# EAGLE schematic Radio (EAGLE 6.1)
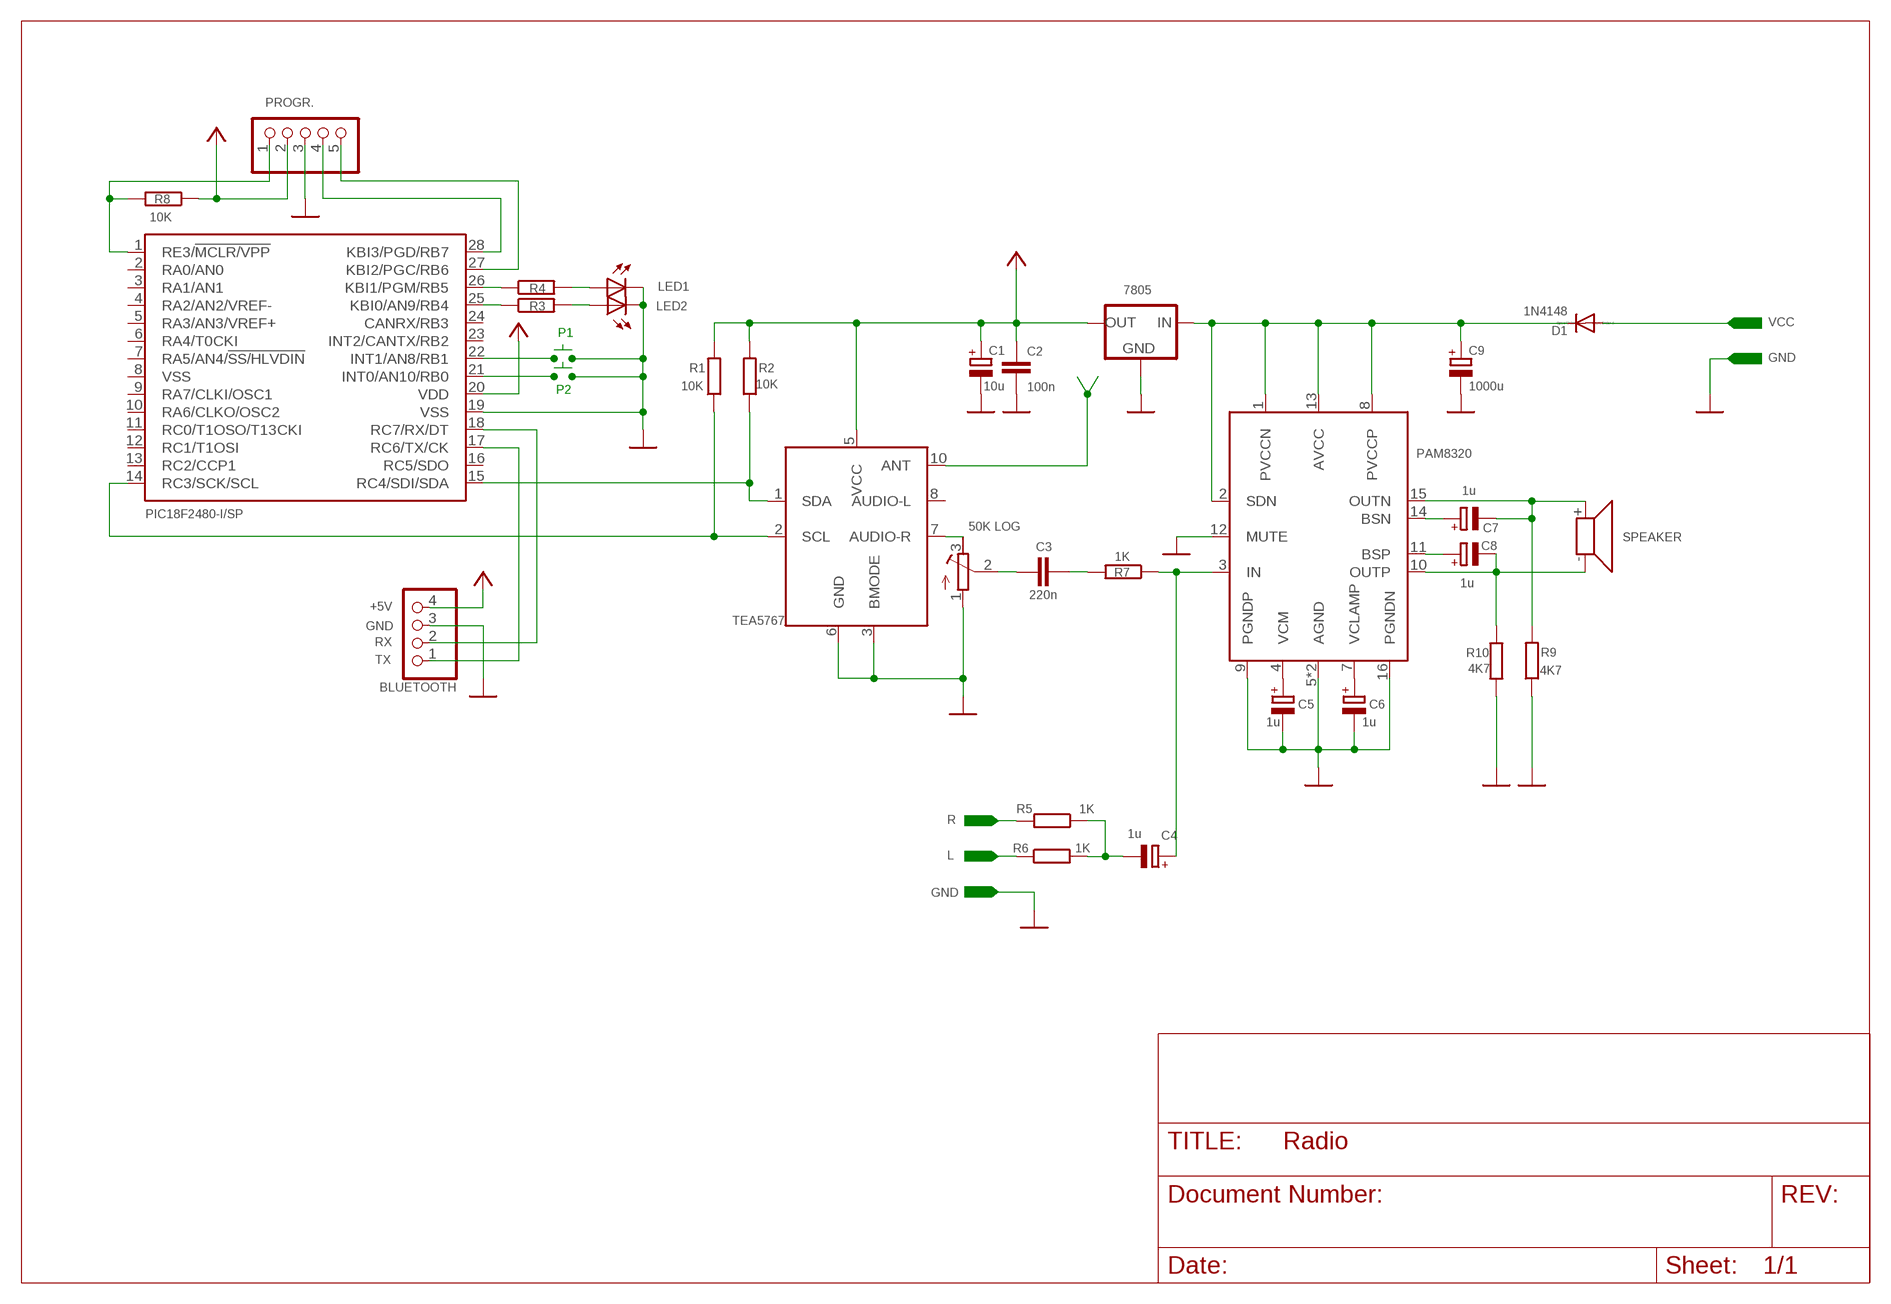
[diagram p0: schematic, sheet 1]

## Parts
7805  78XXL  [78XXL]
BLUETOOTH  PINHD-1X4  [1X04]
C1  10u  CPOL-EUE2,5-6E  [E2,5-6E]
C2  100n  C-EU050-024X044  [C050-024X044]
C3  220n  C-EU050-024X044  [C050-024X044]
C4  1u  CPOL-EUE2,5-6E  [E2,5-6E]
C5  1u  CPOL-EUE2,5-6E  [E2,5-6E]
C6  1u  CPOL-EUE2,5-6E  [E2,5-6E]
C7  1u  CPOL-EUE2,5-6E  [E2,5-6E]
C8  1u  CPOL-EUE2,5-6E  [E2,5-6E]
C9  1000u  CPOL-EUE5-13  [E5-13]
D1  1N4148  1N4148DO35-7  [DO35-7]
IC2  PIC18F2480-I/SP  [DIL28-3]
LED1  LED5MM  [LED5MM]
LED2  LED5MM  [LED5MM]
PAM8320  PAM8320  [DIL16]
POT1  50K LOG  R-TRIMM64X  [RTRIM64X]
PROGR.  PINHD-1X55X2MM  [1_05X2MM]
R1  10K  R-EU_0207/10  [0207/10]
R2  10K  R-EU_0207/10  [0207/10]
R3  2x330  R-EU_0207/10  [0207/10]
R4  330  R-EU_0207/10  [0207/10]
R5  1K  R-EU_0207/10  [0207/10]
R6  1K  R-EU_0207/10  [0207/10]
R7  1K  R-EU_0207/10  [0207/10]
R8  10K  R-EU_0207/10  [0207/10]
R9  4K7  R-EU_0207/10  [0207/10]
R10  4K7  R-EU_0207/10  [0207/10]
SPEAKER  SMS-1308MS-2-R  [SMS-1308MS-2-R]
TEA5767  TEA5767  [TEA5767]

## Nets
+5V: 7805.OUT BLUETOOTH.4 C1.+ C2.1 IC2.20(VDD) PROGR..2 R1.2 R2.2 R8.1 TEA5767.5(VCC)
GND: 7805.GND BLUETOOTH.3 C1.- C2.2 C5.- C6.- C9.- IC2.19(VSS) LED1.K(C) LED2.K(C) PAM8320.5(AGND) PAM8320.6(AGND) PAM8320.9(PGNDP) PAM8320.12(MUTE) PAM8320.16(PGNDN) POT1.1(A) PROGR..3 R9.1 R10.2 TEA5767.3(BMODE) TEA5767.6(GND)
N$2: IC2.15(RC4/SDI/SDA) R2.1 TEA5767.1(SDA)
N$3: LED1.A R4.2
N$4: POT1.3(E) TEA5767.7(AUDIO-R)
N$5: C3.1 POT1.2(S)
N$6: TEA5767.10(ANT)
N$7: C3.2 R7.2
N$8: R5.2
N$9: R6.1
N$10: C4.+ PAM8320.3(IN) R7.1
N$11: IC2.14(RC3/SCK/SCL) R1.1 TEA5767.2(SCL)
N$12: 7805.IN C9.+ D1.C PAM8320.1(PVCCN) PAM8320.2(SDN) PAM8320.8(PVCCP) PAM8320.13(AVCC)
N$13: D1.A
N$14: C5.+ PAM8320.4(VCM)
N$15: C6.+ PAM8320.7(VCLAMP)
N$16: C8.+ PAM8320.11(BSP)
N$17: C7.+ PAM8320.14(BSN)
N$18: C8.- PAM8320.10(OUTP) R10.1 SPEAKER.-
N$19: C7.- PAM8320.15(OUTN) R9.2 SPEAKER.+
N$20: IC2.21(INT0/AN10/RB0) IC2.22(INT1/AN8/RB1)
N$21: IC2.1(RE3/!MCLR/VPP) PROGR..1 R8.2
N$22: LED2.A R3.2
N$24: IC2.28(KBI3/PGD/RB7) PROGR..4
N$27: IC2.27(KBI2/PGC/RB6) PROGR..5
N$28: IC2.25(KBI0/AN9/RB4) R3.1
N$29: IC2.26(KBI1/PGM/RB5) R4.1
N$31: C4.- R5.1 R6.2
RX: BLUETOOTH.2 IC2.18(RC7/RX/DT)
TX: BLUETOOTH.1 IC2.17(RC6/TX/CK)
Unconnected: IC2.2(RA0/AN0) IC2.3(RA1/AN1) IC2.4(RA2/AN2/VREF-) IC2.5(RA3/AN3/VREF+) IC2.6(RA4/T0CKI) IC2.7(RA5/AN4/!SS/HLVDIN) IC2.9(RA7/CLKI/OSC1) IC2.10(RA6/CLKO/OSC2) IC2.11(RC0/T1OSO/T13CKI) IC2.12(RC1/T1OSI) IC2.13(RC2/CCP1) IC2.16(RC5/SDO) IC2.23(INT2/CANTX/RB2) IC2.24(CANRX/RB3) TEA5767.8(AUDIO-L)

## Notes on the sheet
- VCC
- P1
- GND
- P2
- PAM8320
- TEA5767
- R
- L
- GND

## Power pins joined to a net without a drawn wire
VSS: IC2.8(VSS)

## Library data of the parts
7805 = v-reg:78XXL: VOLTAGE REGULATOR
BLUETOOTH = pinhead:PINHD-1X4: PIN HEADER
C1 C4-C9 = rcl:CPOL-EU: POLARIZED CAPACITOR, European symbol
C2 C3 = rcl:C-EU: CAPACITOR, European symbol
D1 = diode:1N4148: DIODE high speed (Philips)
IC2 = microchip:PIC18F2*80: 28-Pin Enhanced Flash Microcontrollers with ECAN(TM) Technology 10-Bit A/D and nanoWatt Technology Source: http://www.microchip.com .. 39637a.pdf; MF: MICROCHIP; MPN: PIC18F2480-I/SP; OC_FARNELL: 9321217; OC_NEWARK: 71J7237
LED1 LED2 = led:LED: LED OSRAM: - CHIPLED LG R971, LG N971, LY N971, LG Q971, LY Q971, LO R971, LY R971 LH N974, LH R974 LS Q976, LO Q976, LY Q976 LO Q996 - Hyper CHIPLED LW Q18S LB Q993, LB Q99A, LB R99A - SideLED LS A670, LO A670, LY A670, LG A670, LP A670 LB A673, LV A673, LT A673, LW A673 LH A674 LY A675 LS A676, LA A676, LO A676, LY A676, LW A676 LS A679, LY A679, LG A679 - Hyper Micro SIDELED® LS Y876, LA Y876, LO Y876, LY Y876 LT Y87S - SmartLED LW L88C, LW L88S LB L89C, LB L89S, LG L890 LS L89K, LO L89K, LY L89K LS L896, LA L896, LO L896, LY L896 - TOPLED LS T670, LO T670, LY T670, LG T670, LP T670 LSG T670, LSP T670, LSY T670, LOP T670, LYG T670 LG T671, LOG T671, LSG T671 LB T673, LV T673, LT T673, LW T673 LH T674 LS T676, LA T676, LO T676, LY T676, LB T676, LH T676, LSB T676, LW T676 LB T67C, LV T67C, LT T67C, LS T67K, LO T67K, LY T67K, LW E67C LS E67B, LA E67B, LO E67B, LY E67B, LB E67C, LV E67C, LT E67C LW T67C LS T679, LY T679, LG T679 LS T770, LO T770, LY T770, LG T770, LP T770 LB T773, LV T773, LT T773, LW T773 LH T774 LS E675, LA E675, LY E675, LS T675 LS T776, LA T776, LO T776, LY T776, LB T776 LHGB T686 LT T68C, LB T68C - Hyper Mini TOPLED® LB M676 - Mini TOPLED Santana® LG M470 LS M47K, LO M47K, LY M47K Source: http://www.osram.convergy.de LUXEON: - LUMILED® LXK2-PW12-R00, LXK2-PW12-S00, LXK2-PW14-U00, LXK2-PW14-V00 LXK2-PM12-R00, LXK2-PM12-S00, LXK2-PM14-U00 LXK2-PE12-Q00, LXK2-PE12-R00, LXK2-PE12-S00, LXK2-PE14-T00, LXK2-PE14-U00 LXK2-PB12-K00, LXK2-PB12-L00, LXK2-PB12-M00, LXK2-PB14-N00, LXK2-PB14-P00, LXK2-PB14-Q00 LXK2-PR12-L00, LXK2-PR12-M00, LXK2-PR14-Q00, LXK2-PR14-R00 LXK2-PD12-Q00, LXK2-PD12-R00, LXK2-PD12-S00 LXK2-PH12-R00, LXK2-PH12-S00 LXK2-PL12-P00, LXK2-PL12-Q00, LXK2-PL12-R00 Source: www.luxeon.com KINGBRIGHT: KA-3528ASYC Source: www.kingbright.com
PAM8320 = PAM8320:PAM8320
POT1 = rcl:R-TRIMM: Trimm resistor
PROGR. = pinhead:PINHD-1X5: PIN HEADER
R1-R10 = rcl:R-EU_: RESISTOR, European symbol
SPEAKER = speaker:SMS-1308MS-2-R: Speaker 13 x 13mm, 8 Ohm, 0.7W Source: pui audio inc. SMS-1308MS-2-R.pdf
TEA5767 = TEA5767:TEA5767